# Altium project Balancer_PCB.PrjPcb
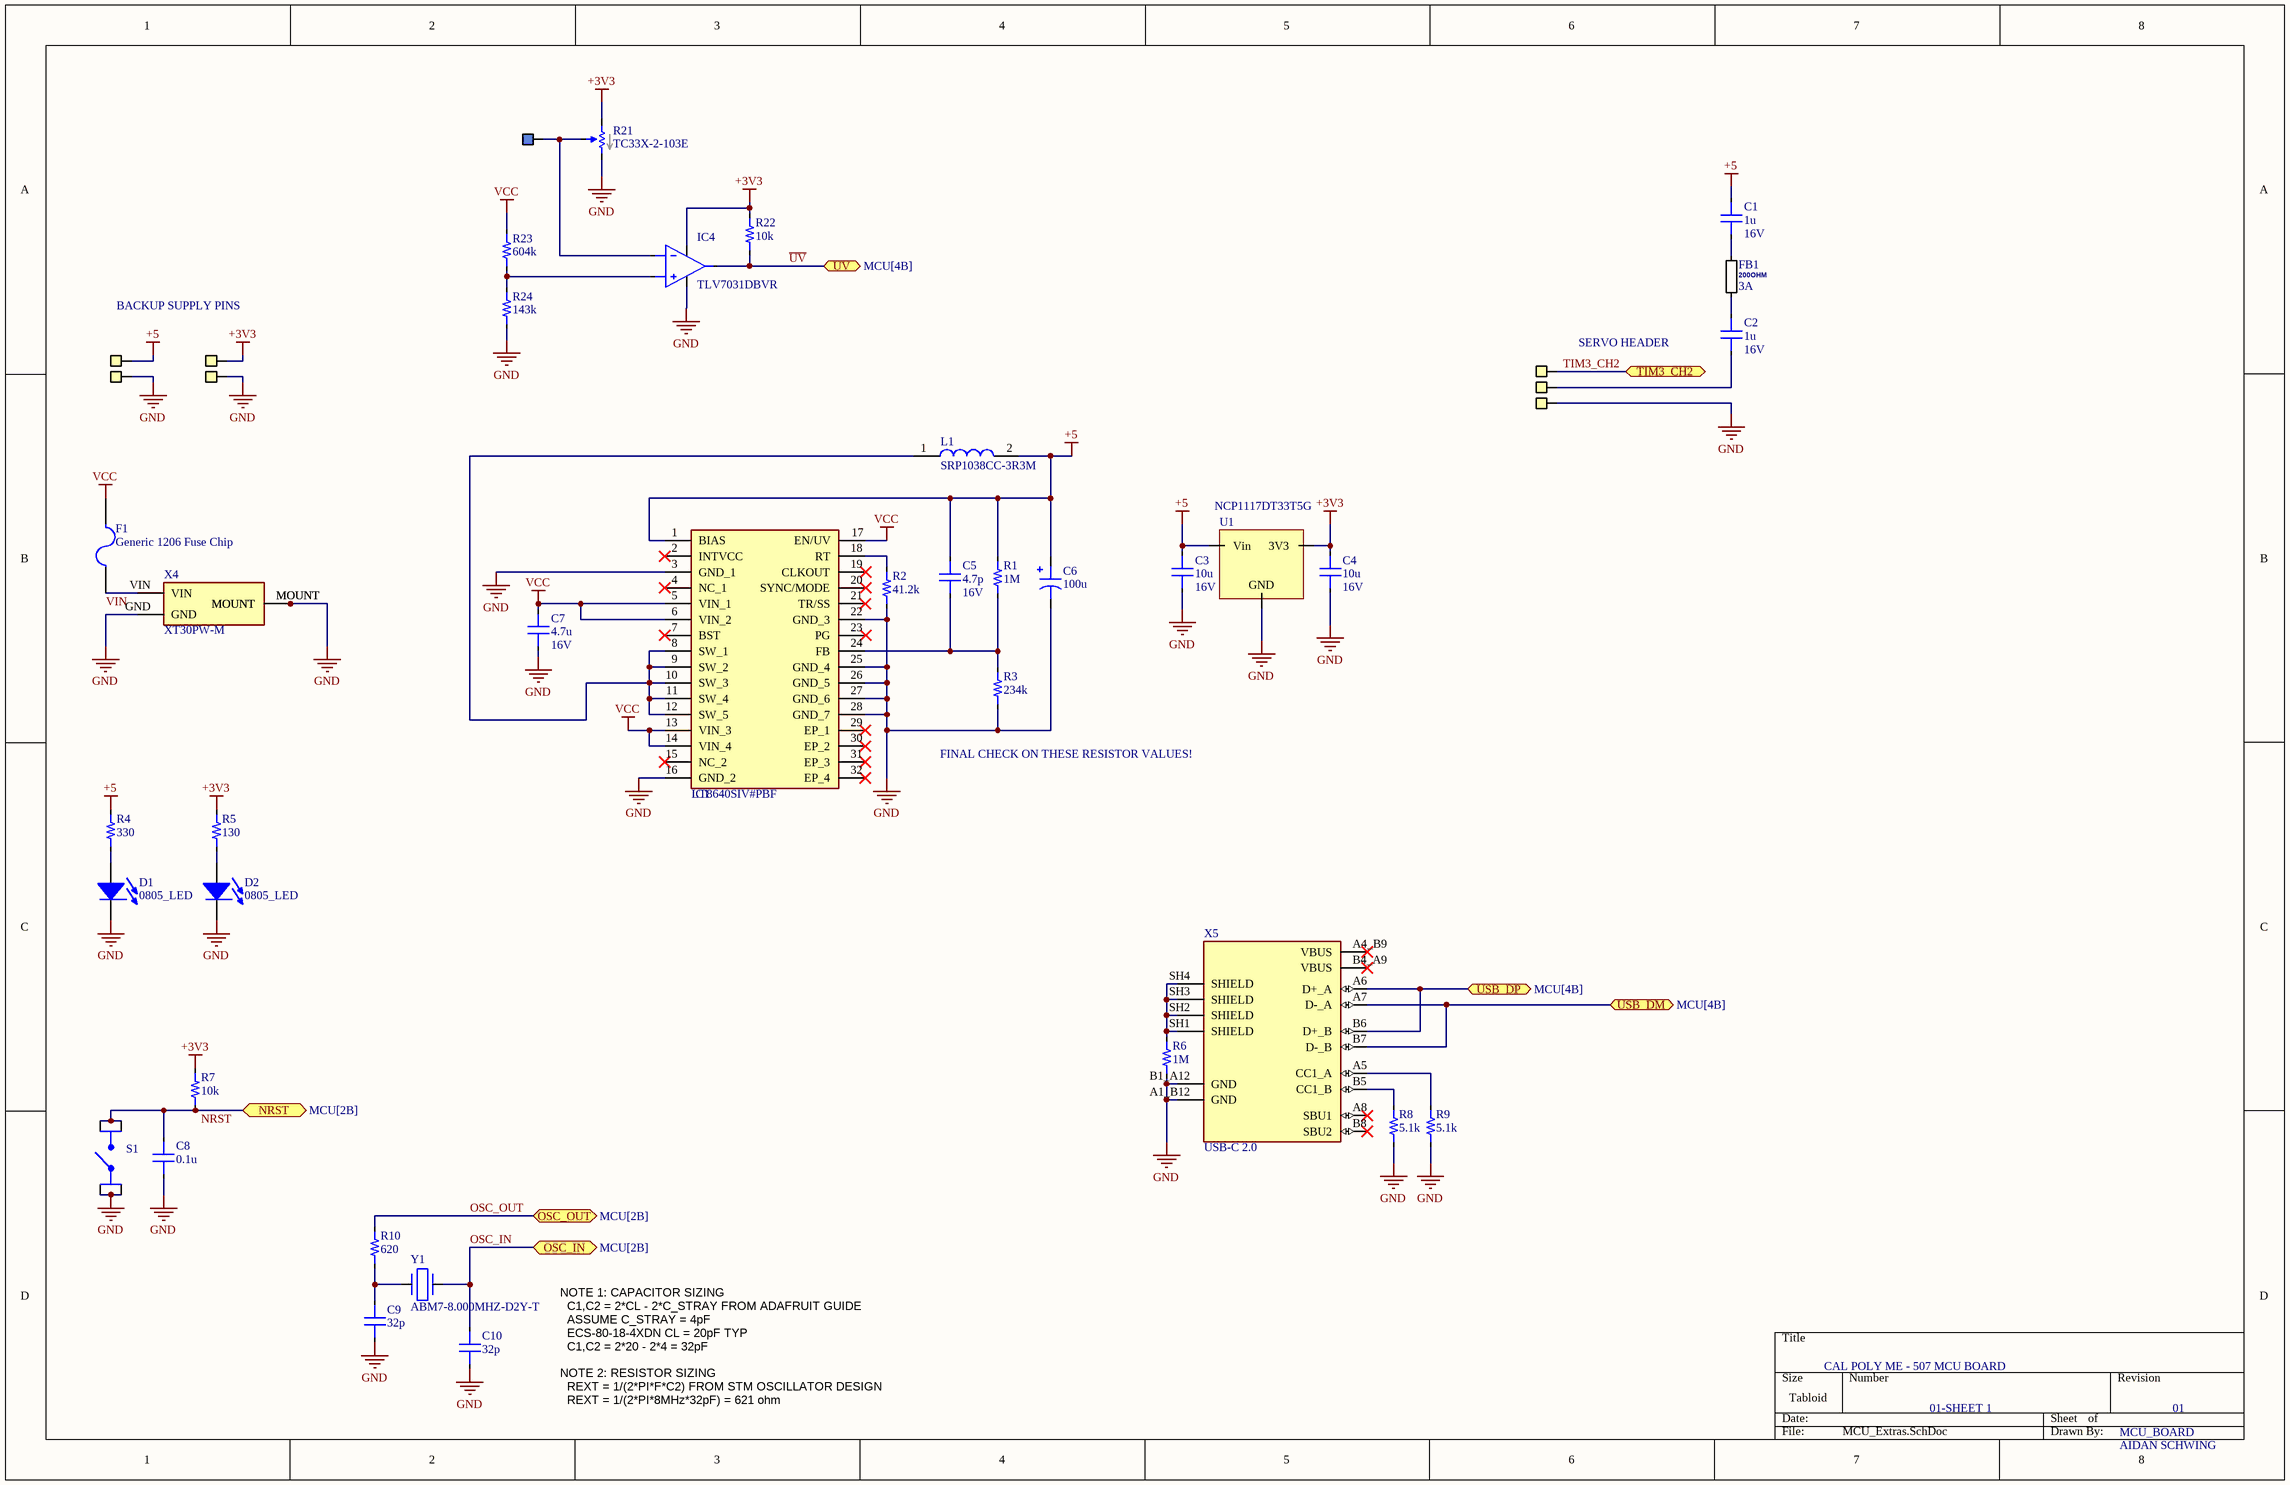
[diagram p0: MCU_Extras.SchDoc]
3 sheets, 93 parts. Net scope: flat (ports and power ports of the same name join across sheets).
Board file: BALANCER_PCB.PcbDoc
Sheets:
  MCU_Extras.SchDoc
  IMU.SchDoc
  MCU.SchDoc

## Sheet MCU_Extras.SchDoc
size Tabloid; SheetNumber: 1; SheetTotal: 3

### Parts
C1  value 1u  Voltage: 16V  [0603_CAP]  (hidden comment: Capacitor)
C2  value 1u  Voltage: 16V  [0603_CAP]  (hidden comment: Capacitor)
C3  value 10u  Voltage: 16V  [0805_CAP]  (hidden comment: Capacitor)
C4  value 10u  Voltage: 16V  [0805_CAP]  (hidden comment: Capacitor)
C5  value 4.7p  Voltage: 16V  [0603_CAP]  (hidden comment: Capacitor)
C6  value 100u  [6.60x6.60x8.00mm_E_CAP]  (hidden comment: 865080343009)
C7  value 4.7u  Voltage: 16V  [0805_CAP]  (hidden comment: Capacitor)
C8  value 0.1u  [0805_CAP]  (hidden comment: Capacitor)
C9  value 32p  [0805_CAP]  (hidden comment: Capacitor)
C10  value 32p  [0805_CAP]  (hidden comment: Capacitor)
D1  0805_LED  [0805_LED]
D2  0805_LED  [0805_LED]
F1  Generic 1206 Fuse Chip  [1206_RES]
FB1  =Z@100MHz: 200OHM  iMax: 3A  [0805_Ferrite]  (hidden comment: *)
IC1  LT8640SIV#PBF  [LT8640SIVPBF]
IC4  TLV7031DBVR  [SOT95P280X145-5N]
L1  SRP1038CC-3R3M  [INDPM110100X400N]
R1  value 1M  [0805_RES]  (hidden comment: Resistor)
R2  value 41.2k  [0805_RES]  (hidden comment: Resistor)
R3  value 234k  [0805_RES]  (hidden comment: Resistor)
R4  value 330  [0603_RES]  (hidden comment: Resistor)
R5  value 130  [0603_RES]  (hidden comment: Resistor)
R6  value 1M  [0805_RES]  (hidden comment: Resistor)
R7  value 10k  [0603_RES]  (hidden comment: Resistor)
R8  value 5.1k  [0805_RES]  (hidden comment: Resistor)
R9  value 5.1k  [0805_RES]  (hidden comment: Resistor)
R10  value 620  [0805_RES]  (hidden comment: Resistor)
R21  TC33X-2-103E  [35WR]
R22  value 10k  [0805_RES]  (hidden comment: Resistor)
R23  value 604k  [0805_RES]  (hidden comment: Resistor)
R24  value 143k  [0805_RES]  (hidden comment: Resistor)
S1  TactileSwitch  [6mmTactileSwitch_ThroughHole]  (value not drawn)
U1  NCP1117DT33T5G  [DPAK3_TO-252-3]
X1  GenericPinHeader(0.1in)  [GenericPinHeader(.1in)]  (value not drawn)
X2  GenericPinHeader(0.1in)  [GenericPinHeader(.1in)]  (value not drawn)
X3  GenericPinHeader(0.1in)  [GenericPinHeader(.1in)]  (value not drawn)
X4  XT30PW-M  [XT30PWM]
X5  USB-C 2.0  [AMPHENOL_12402012E212A]
X11  HeaderPad  [HeaderPad]  (value not drawn)
X19  GenericPinHeader(0.1in)  [GenericPinHeader(.1in)]  (value not drawn)
X22  GenericPinHeader(0.1in)  [GenericPinHeader(.1in)]  (value not drawn)
X23  GenericPinHeader(0.1in)  [GenericPinHeader(.1in)]  (value not drawn)
X26  GenericPinHeader(0.1in)  [GenericPinHeader(.1in)]  (value not drawn)
Y1  ABM7-8.000MHZ-D2Y-T  [ABM7]

### Ports
NRST (bidir, see MCU[2B]), OSC_IN (bidir, see MCU[2B]), OSC_OUT (bidir, see MCU[2B]), TIM3_CH2 (bidir, see MCU[4B]), USB_DM (bidir, see MCU[4B]), USB_DP (bidir, see MCU[4B]), ~{UV} (bidir, see MCU[4B])

### Nets
+3V3: C4.1 IC4.5(VCC) R5.2 R7.2 R21.1 R22.2 U1.4(3V3) X22.1(Pin)
+5: C1.1 C3.1 C5.1 C6.1 IC1.1(BIAS) L1.2 R1.2 R4.2 U1.3(Vin) X19.1(Pin)
GND: C3.2 C4.2 C6.2 C7.2 C8.1 C9.1 C10.1 D1.2(K) D2.2(K) IC1.3(GND_1) IC1.16(GND_2) IC1.22(GND_3) IC1.25(GND_4) IC1.26(GND_5) IC1.27(GND_6) IC1.28(GND_7) IC4.2(VEE) R2.1 R3.1 R6.1 R8.1 R9.1 R21.3 R24.1 S1.1 S1.2 U1.1(GND) X3.1(Pin) X4.GND X4.MOUNT X5.A1_B12(GND) X5.B1_A12(GND) X23.1(Pin) X26.1(Pin)
VCC: C7.1 F1.2 IC1.5(VIN_1) IC1.6(VIN_2) IC1.13(VIN_3) IC1.14(VIN_4) IC1.17(EN/UV) R23.2
NRST: C8.2 R7.1 S1.3 S1.4 ; port NRST
OSC_IN: C10.2 Y1.2 ; port OSC_IN
OSC_OUT: R10.2 ; port OSC_OUT
TIM3_CH2: X1.1(Pin) ; port TIM3_CH2
~{UV}: IC4.1(OUT) R22.1 ; port ~{UV}
USB_DM: X5.A7(D-_A) X5.B7(D-_B) ; port USB_DM
USB_DP: X5.A6(D+_A) X5.B6(D+_B) ; port USB_DP
VIN: F1.1 X4.VIN
NetC1_2: C1.2 FB1.2
NetC2_1: C2.1 FB1.1
NetC2_2: C2.2 X2.1(Pin)
NetC5_2: C5.2 IC1.24(FB) R1.1 R3.2
NetC9_2: C9.2 R10.1 Y1.1
NetD1_1: D1.1(A) R4.1
NetD2_1: D2.1(A) R5.1
NetIC1_8: IC1.8(SW_1) IC1.9(SW_2) IC1.10(SW_3) IC1.11(SW_4) IC1.12(SW_5) L1.1
NetIC1_18: IC1.18(RT) R2.2
NetIC4_3: IC4.3(IN+) R23.1 R24.2
NetIC4_4: IC4.4(IN-) R21.2 X11.1(Pin)
NetR6_2: R6.2 X5.SH1(SHIELD) X5.SH2(SHIELD) X5.SH3(SHIELD) X5.SH4(SHIELD)
NetR8_2: R8.2 X5.B5(CC1_B)
NetR9_2: R9.2 X5.A5(CC1_A)

Not connected (* = marked no-connect by the designer): IC1 2(INTVCC)* 4(NC_1)* 7(BST)* 15(NC_2)* 19(CLKOUT)* 20(SYNC/MODE)* 21(TR/SS)* 23(PG)* 29(EP_1)* 30(EP_2)* 31(EP_3)* 32(EP_4)*; X5 A4_B9(VBUS)* A8(SBU1)* B4_A9(VBUS)* B8(SBU2)*

### Notes on the sheet
- BACKUP SUPPLY PINS
- SERVO HEADER
- (near R3) FINAL CHECK ON THESE RESISTOR VALUES!
- CAL POLY ME - 507 MCU BOARD
- NOTE 1: CAPACITOR SIZING
  C1,C2 = 2*CL - 2*C_STRAY FROM ADAFRUIT GUIDE
  ASSUME C_STRAY = 4pF
  ECS-80-18-4XDN CL = 20pF TYP
  C1,C2 = 2*20 - 2*4 = 32pF
  NOTE 2: RESISTOR SIZING
  REXT = 1/(2*PI*F*C2) FROM STM OSCILLATOR DESIGN
  REXT = 1/(2*PI*8MHz*32pF) = 621 ohm
- 01-SHEET 1
- MCU_BOARD
- 01
- AIDAN SCHWING

### Library data of the parts
C6 = 865080343009: CAP ALUM 100UF 20% 16V SMD; Percent Tolerance: 20; Dielectric: *; ESR: *; ComponentLink1Description: Digikey; ComponentLink1URL: https://www.digikey.com/en/products/detail/w%C3%BCrth-elektronik/865080343009/5728014
D1 D2 = 0805_LED: Generic 0805 LED
FB1 = ChipFerrite: Link: *; MfrPartNo: *; Name: *; Resistance: *; Package: *; Inductance: *
IC1 = LT8640SIV#PBF: Integrated Circuit; Manufacturer_Name: Analog Devices; Datasheet Link: https://www.analog.com/LT8640S/datasheet; Height: 1.03mm; Manufacturer_Part_Number: LT8640SIV#PBF; Mouser Part Number: 584-LT8640SIVPBF; Mouser Price/Stock: https://www.mouser.co.uk/ProductDetail/Analog-Devices/LT8640SIVPBF?qs=5aG0NVq1C4wLdtPauIE3hA%3D%3D; Arrow Part Number: LT8640SIV#PBF; Arrow Price/Stock: https://www.arrow.com/en/products/lt8640sivpbf/analog-devices
IC4 = TLV7031DBVR: Analog Comparators Nanopower, small size comparator with push-pull output 5-SOT-23 -40 to 125C range; Manufacturer_Name: Texas Instruments; Datasheet Link: http://www.ti.com/lit/gpn/TLV7031; Height: 1.45mm; Manufacturer_Part_Number: TLV7031DBVR; Mouser Part Number: 595-TLV7031DBVR; Mouser Price/Stock: https://www.mouser.co.uk/ProductDetail/Texas-Instruments/TLV7031DBVR?qs=EBDBlbfErPzxbC0zg598sw%3D%3D; Arrow Part Number: TLV7031DBVR; Arrow Price/Stock: https://www.arrow.com/en/products/tlv7031dbvr/texas-instruments?region=nac
L1 = SRP1038CC-3R3M: Inductor, 3.3uH; Manufacturer_Name: Bourns; Manufacturer_Part_Number: SRP1038CC-4R7M; Datasheet Link: https://www.digikey.com/en/products/detail/bourns-inc/SRP1038CC-3R3M/21263957?s=N4IgTCBcDaIMoCUAKBGADAZgBwGEcFoMEMBZEAXQF8g; Height: 4mm
R21 = TC33X-2-103E: 0.1W, 1/10W J Lead Surface Mount Trimmer Potentiometer Cermet Turn Top Adjustment; Value: 10k; ComponentLink1Description: Digikey; ComponentLink1URL: https://www.digikey.com/en/products/detail/bourns-inc/TC33X-2-103E/612911; Power: 1/10W
S1 = TactileSwitch: Generic 6mm Through Hole Tactile Switch; Current: 0.05A; MaxVoltage: 12V; Pole: 1; Name: TactileSwitch; Mounting: TH; ComponentLink1Description: Digikey; ComponentLink1URL: https://www.digikey.com/en/products/detail/c-k/PTS645SH95-2-LFS/1146763
U1 = NCP1117DT33T5G: IC REG LINEAR 3.3V 1A DPAK
X1-X3 X19 X22 X23 X26 = GenericPinHeader(0.1in): Generic .1in(2.54mm) pitch pin header
X4 = XT30PW-M: Socket; DC supply; XT30; male; PIN: 2; on PCBs; THT; yellow; 15A; 500V; Manufacturer_Name: Amass; Datasheet Link: https://www.tme.eu/sl/Document/ce4077e36b79046da520ca73227e15de/XT30PW%20SPEC.pdf; Height: 5mm; Manufacturer_Part_Number: XT30PW-M
X5 = 12402012E212A: CONN RCP USB2.0 TYP C 24P SMD RA; MF: {'manufacturer': u'Amphenol'}; Package: None; Price: None; Value: *; MP: 12402012E212A; Availability: Unavailable
X11 = HeaderPad: Pad for pin header
Y1 = ABM7-8.000MHZ-D2Y-T: Crystal or Oscillator; Manufacturer_Name: ABRACON; Datasheet Link: https://abracon.com/Resonators/abm7.pdf; Height: 1.4mm; Manufacturer_Part_Number: ABM7-8.000MHZ-D2Y-T; Mouser Part Number: 815-ABM7-8-D2Y-T; Mouser Price/Stock: https://www.mouser.co.uk/ProductDetail/ABRACON/ABM7-8.000MHZ-D2Y-T?qs=LoTOQoUkC8SFsmY8snleBA%3D%3D; Arrow Part Number: ABM7-8.000MHZ-D2Y-T; Arrow Price/Stock: https://www.arrow.com/en/products/abm7-8.000mhz-d2y-t/abracon?region=europe
C1-C5 C7-C10 = Capacitor: Dielectric: *; Percent Tolerance: *; ESR: *
R1-R10 R22-R24 = Resistor: Tolerance: *

## Sheet IMU.SchDoc
size Letter; SheetNumber: 2; SheetTotal: 3
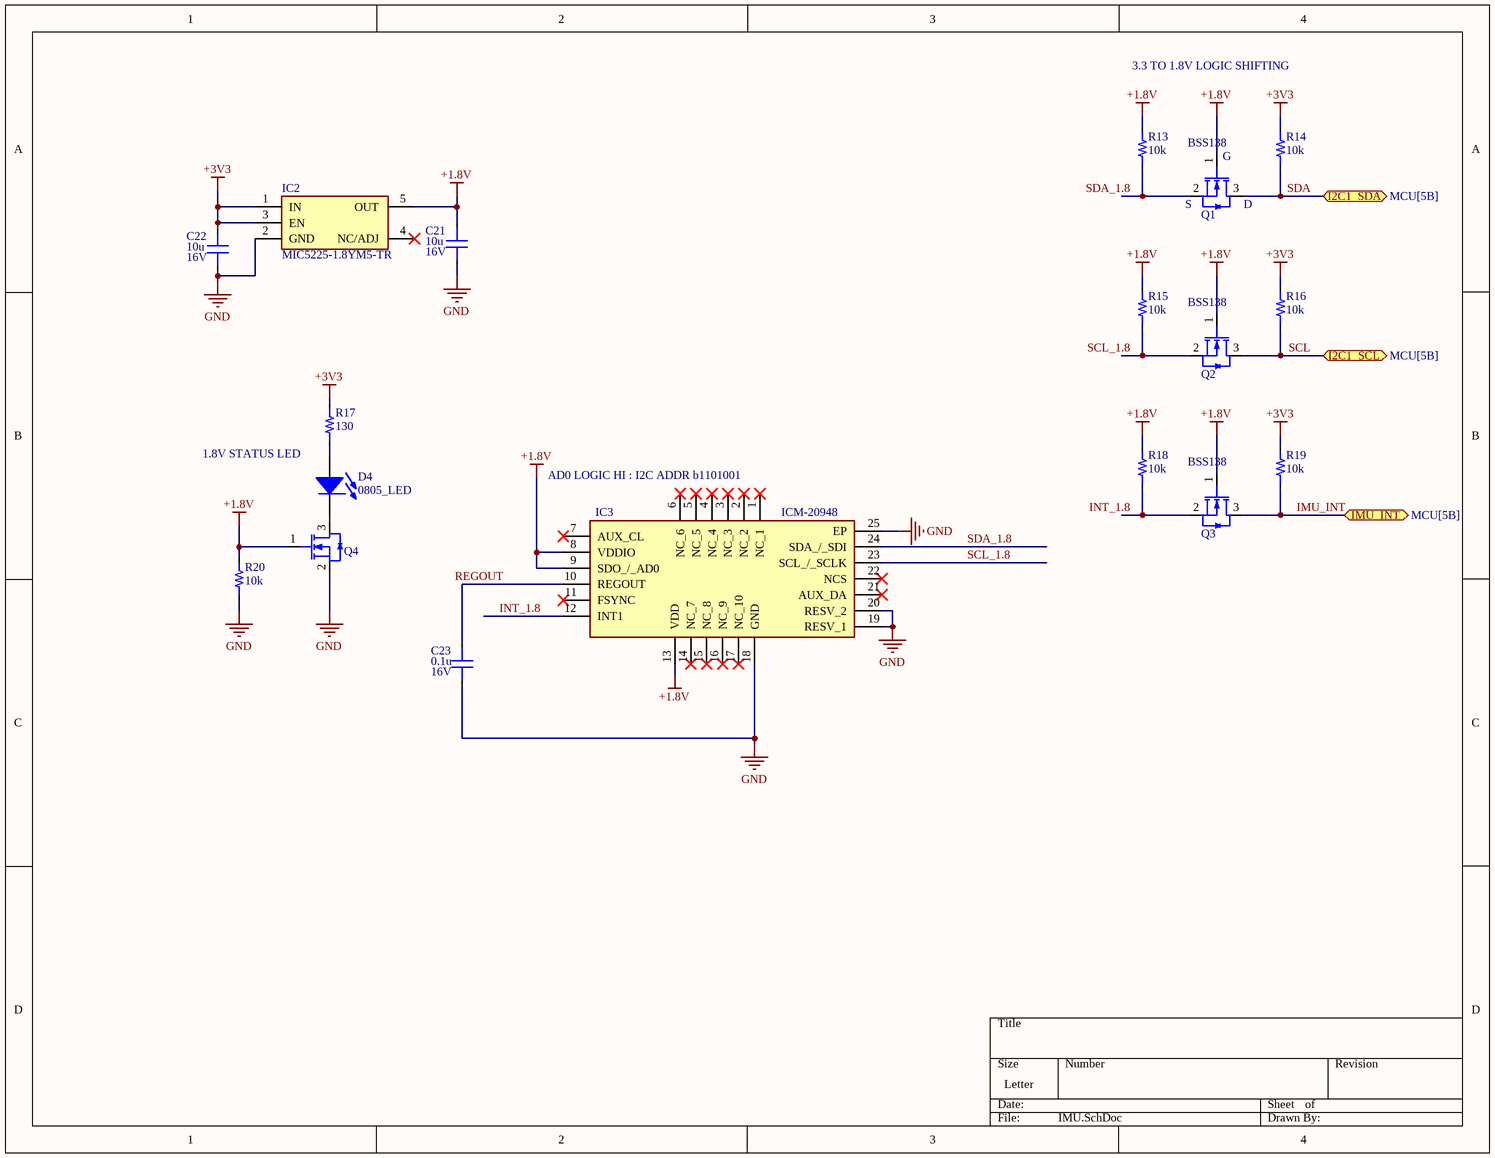
[diagram p1: IMU.SchDoc]

### Parts
C21  value 10u  Voltage: 16V  [0603_CAP]  (hidden comment: Capacitor)
C22  value 10u  Voltage: 16V  [0603_CAP]  (hidden comment: Capacitor)
C23  value 0.1u  Voltage: 16V  [0603_CAP]  (hidden comment: Capacitor)
D4  0805_LED  [0805_LED]
IC2  MIC5225-1.8YM5-TR  [SOT95P280X130-5N]
IC3  ICM-20948  [QFN40P300X300X105-25N-D]
Q1  BSS138  [SOT95P240X120-3N]
Q2  BSS138  [SOT95P240X120-3N]
Q3  BSS138  [SOT95P240X120-3N]
Q4  BSS138  [SOT95P240X120-3N]  (value not drawn)
R13  value 10k  [0603_RES]  (hidden comment: Resistor)
R14  value 10k  [0603_RES]  (hidden comment: Resistor)
R15  value 10k  [0603_RES]  (hidden comment: Resistor)
R16  value 10k  [0603_RES]  (hidden comment: Resistor)
R17  value 130  [0603_RES]  (hidden comment: Resistor)
R18  value 10k  [0603_RES]  (hidden comment: Resistor)
R19  value 10k  [0603_RES]  (hidden comment: Resistor)
R20  value 10k  [0603_RES]  (hidden comment: Resistor)

### Ports
I2C1_SCL (bidir, see MCU[5B]), I2C1_SDA (bidir, see MCU[5B]), IMU_INT (bidir, see MCU[5B])

### Nets
+1.8V: C21.2 IC2.5(OUT) IC3.8(VDDIO) IC3.9(SDO_/_AD0) IC3.13(VDD) Q1.1(G) Q2.1(G) Q3.1(G) Q4.1(G) R13.2 R15.2 R18.2 R20.2
+3V3: C22.2 IC2.1(IN) IC2.3(EN) R14.2 R16.2 R17.2 R19.2
GND: C21.1 C22.1 C23.1 IC2.2(GND) IC3.18(GND) IC3.19(RESV_1) IC3.20(RESV_2) IC3.25(EP) Q4.2(S) R20.1
IMU_INT: Q3.3(D) R19.1 ; port IMU_INT
INT_1.8: IC3.12(INT1) Q3.2(S) R18.1
REGOUT: C23.2 IC3.10(REGOUT)
SCL: Q2.3(D) R16.1 ; port I2C1_SCL
SCL_1.8: IC3.23(SCL_/_SCLK) Q2.2(S) R15.1
SDA: Q1.3(D) R14.1 ; port I2C1_SDA
SDA_1.8: IC3.24(SDA_/_SDI) Q1.2(S) R13.1
NetD4_1: D4.1(A) R17.1
NetD4_2: D4.2(K) Q4.3(D)

Not connected (* = marked no-connect by the designer): IC2 4(NC/ADJ)*; IC3 1(NC_1)* 2(NC_2)* 3(NC_3)* 4(NC_4)* 5(NC_5)* 6(NC_6)* 7(AUX_CL)* 11(FSYNC)* 14(NC_7)* 15(NC_8)* 16(NC_9)* 17(NC_10)* 21(AUX_DA)* 22(NCS)*

### Notes on the sheet
- 3.3 TO 1.8V LOGIC SHIFTING
- (near Q1) G
- (near Q1) S
- (near Q1) D
- 1.8V STATUS LED
- (near IC3) AD0 LOGIC HI : I2C ADDR b1101001

### Library data of the parts
D4 = 0805_LED: Generic 0805 LED
IC2 = MIC5225-1.8YM5-TR: Integrated Circuit; Manufacturer_Name: Microchip; Datasheet Link: http://www.microchip.com/mymicrochip/filehandler.aspx?ddocname=en579718; Height: 1.3mm; Manufacturer_Part_Number: MIC5225-1.8YM5-TR; Mouser Part Number: 998-MIC5225-1.8YM5TR; Mouser Price/Stock: https://www.mouser.co.uk/ProductDetail/Microchip-Technology/MIC5225-1.8YM5-TR?qs=U6T8BxXiZAW23RI71jjM5w%3D%3D; Arrow Part Number: MIC5225-1.8YM5-TR; Arrow Price/Stock: https://www.arrow.com/en/products/mic5225-1.8ym5-tr/microchip-technology?region=nac
IC3 = ICM-20948: Integrated Circuit; Manufacturer_Name: TDK; Datasheet Link: https://product.tdk.com/system/files/dam/doc/product/sensor/mortion-inertial/imu/data_sheet/ds-000189-icm-20948-v1.3.pdf; Height: 1.05mm; Manufacturer_Part_Number: ICM-20948; Mouser Part Number: 410-ICM-20948; Mouser Price/Stock: https://www.mouser.co.uk/ProductDetail/TDK-InvenSense/ICM-20948?qs=u4fy%2FsgLU9OtGc31yF%2Friw%3D%3D; Arrow Part Number: ICM-20948; Arrow Price/Stock: https://www.arrow.com/en/products/icm-20948/invensense?region=nac
Q1-Q4 = BSS138: MOSFET (N-Channel); Manufacturer_Name: onsemi; Datasheet Link: https://www.onsemi.com/pub/Collateral/BSS138-D.PDF; Height: 1.2mm; Manufacturer_Part_Number: BSS138; Mouser Part Number: 512-BSS138; Mouser Price/Stock: https://www.mouser.co.uk/ProductDetail/onsemi-Fairchild/BSS138?qs=HK%252BeIG1iaahCeqBvjB4arg%3D%3D; Arrow Part Number: BSS138; Arrow Price/Stock: https://www.arrow.com/en/products/bss138/on-semiconductor
C21-C23 = Capacitor: Dielectric: *; Percent Tolerance: *; ESR: *
R13-R20 = Resistor: Tolerance: *

## Sheet MCU.SchDoc
size Tabloid; SheetNumber: 3; SheetTotal: 3
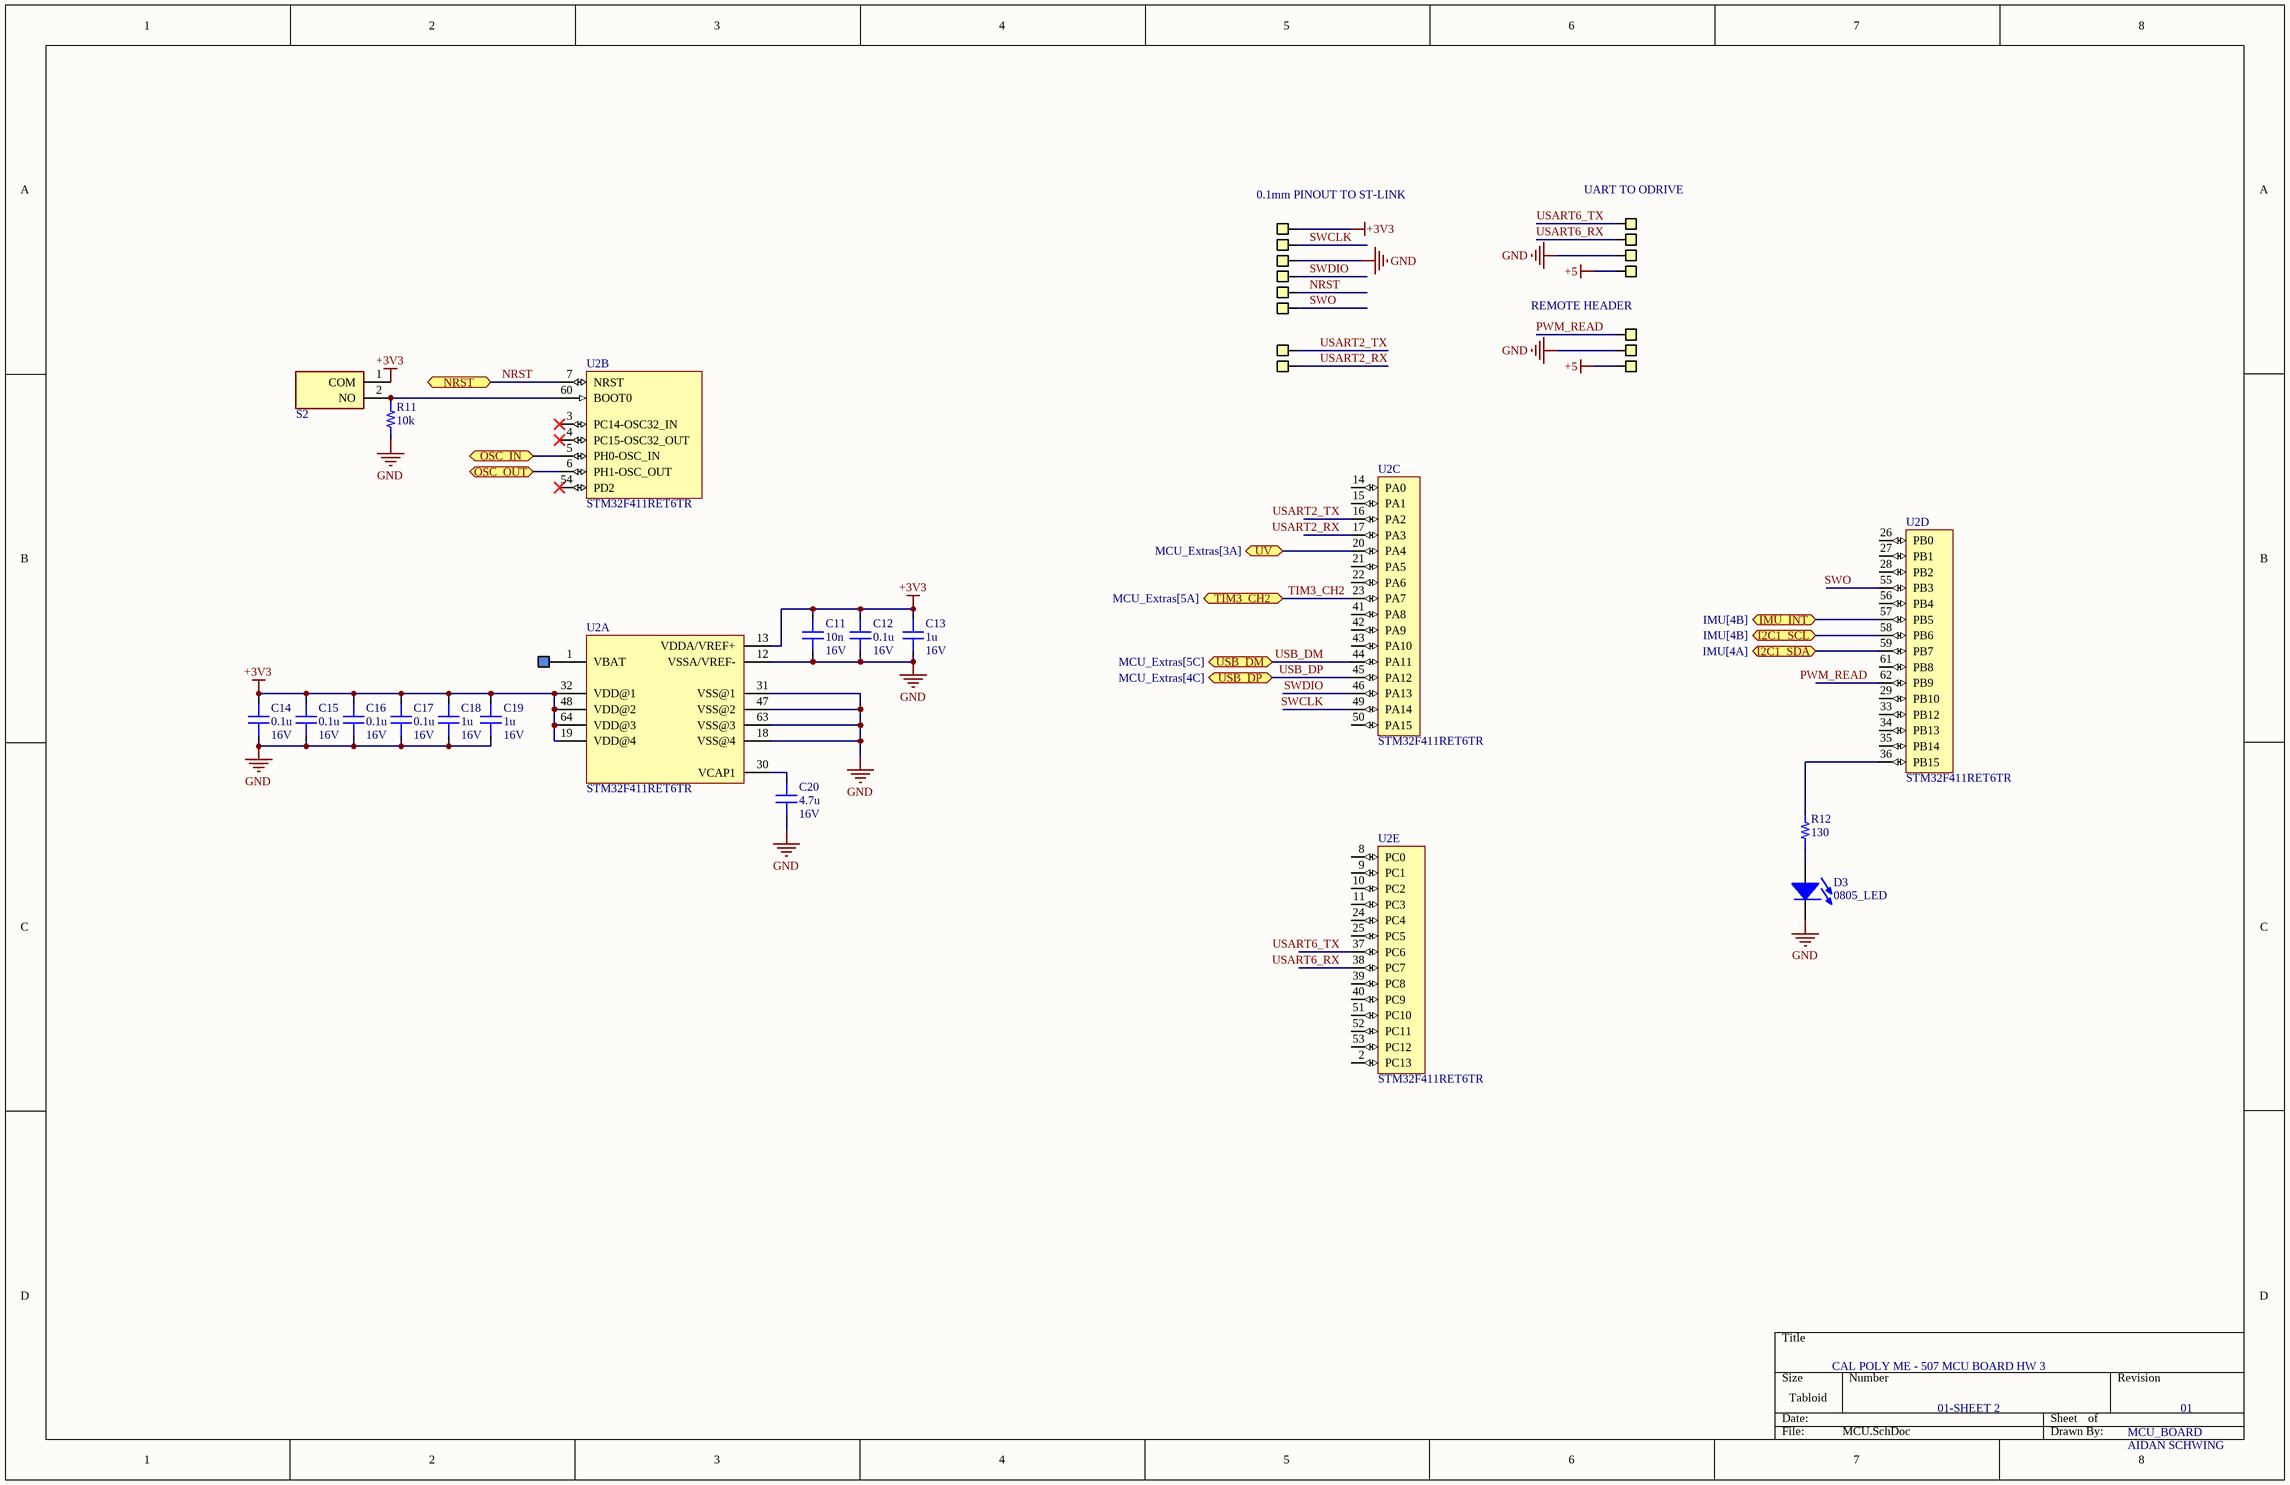
[diagram p2: MCU.SchDoc]

### Parts
C11  value 10n  Voltage: 16V  [0805_CAP]  (hidden comment: Capacitor)
C12  value 0.1u  Voltage: 16V  [0805_CAP]  (hidden comment: Capacitor)
C13  value 1u  Voltage: 16V  [0805_CAP]  (hidden comment: Capacitor)
C14  value 0.1u  Voltage: 16V  [0805_CAP]  (hidden comment: Capacitor)
C15  value 0.1u  Voltage: 16V  [0805_CAP]  (hidden comment: Capacitor)
C16  value 0.1u  Voltage: 16V  [0805_CAP]  (hidden comment: Capacitor)
C17  value 0.1u  Voltage: 16V  [0805_CAP]  (hidden comment: Capacitor)
C18  value 1u  Voltage: 16V  [0805_CAP]  (hidden comment: Capacitor)
C19  value 1u  Voltage: 16V  [0805_CAP]  (hidden comment: Capacitor)
C20  value 4.7u  Voltage: 16V  [0805_CAP]  (hidden comment: Capacitor)
D3  0805_LED  [0805_LED]
R11  value 10k  [0603_RES]  (hidden comment: Resistor)
R12  value 130  [0603_RES]  (hidden comment: Resistor)
S2  DS04-254-2-01BK-SMT-TR  [DS04254201BKSMTTR]  (value not drawn)
U2  STM32F411RET6TR  [QFP50P1200X1200X160-64N]  (parts A,B,C,D,E of 5)
X6  GenericPinHeader(0.1in)  [GenericPinHeader(.1in)]  (value not drawn)
X7  GenericPinHeader(0.1in)  [GenericPinHeader(.1in)]  (value not drawn)
X8  GenericPinHeader(0.1in)  [GenericPinHeader(.1in)]  (value not drawn)
X9  GenericPinHeader(0.1in)  [GenericPinHeader(.1in)]  (value not drawn)
X10  GenericPinHeader(0.1in)  [GenericPinHeader(.1in)]  (value not drawn)
X12  GenericPinHeader(0.1in)  [GenericPinHeader(.1in)]  (value not drawn)
X13  GenericPinHeader(0.1in)  [GenericPinHeader(.1in)]  (value not drawn)
X14  GenericPinHeader(0.1in)  [GenericPinHeader(.1in)]  (value not drawn)
X15  GenericPinHeader(0.1in)  [GenericPinHeader(.1in)]  (value not drawn)
X16  GenericPinHeader(0.1in)  [GenericPinHeader(.1in)]  (value not drawn)
X17  HeaderPad  [HeaderPad]  (value not drawn)
X18  GenericPinHeader(0.1in)  [GenericPinHeader(.1in)]  (value not drawn)
X20  GenericPinHeader(0.1in)  [GenericPinHeader(.1in)]  (value not drawn)
X21  GenericPinHeader(0.1in)  [GenericPinHeader(.1in)]  (value not drawn)
X24  GenericPinHeader(0.1in)  [GenericPinHeader(.1in)]  (value not drawn)
X25  GenericPinHeader(0.1in)  [GenericPinHeader(.1in)]  (value not drawn)

### Ports
I2C1_SCL (bidir, see IMU[4B]), I2C1_SDA (bidir, see IMU[4A]), IMU_INT (bidir, see IMU[4B]), NRST (bidir, see MCU_Extras[1C]), OSC_IN (bidir, see MCU_Extras[2D]), OSC_OUT (bidir, see MCU_Extras[2D]), TIM3_CH2 (bidir, see MCU_Extras[5A]), USB_DM (bidir, see MCU_Extras[5C]), USB_DP (bidir, see MCU_Extras[4C]), ~{UV} (bidir, see MCU_Extras[3A])

### Nets
+3V3: C11.1 C12.1 C13.1 C14.1 C15.1 C16.1 C17.1 C18.1 C19.1 S2.1(COM) U2.13(VDDA/VREF+) U2.19(VDD@4) U2.32(VDD@1) U2.48(VDD@2) U2.64(VDD@3) X7.1(Pin)
+5: X21.1(Pin) X25.1(Pin)
GND: C11.2 C12.2 C13.2 C14.2 C15.2 C16.2 C17.2 C18.2 C19.2 C20.2 D3.2(K) R11.1 U2.12(VSSA/VREF-) U2.18(VSS@4) U2.31(VSS@1) U2.47(VSS@2) U2.63(VSS@3) X10.1(Pin) X20.1(Pin) X24.1(Pin)
IMU_INT: U2.57(PB5) ; port IMU_INT
NRST: U2.7(NRST) X13.1(Pin) ; port NRST
OSC_IN: U2.5(PH0-OSC_IN) ; port OSC_IN
OSC_OUT: U2.6(PH1-OSC_OUT) ; port OSC_OUT
PWM_READ: U2.62(PB9) X18.1(Pin)
SCL: U2.58(PB6) ; port I2C1_SCL
SDA: U2.59(PB7) ; port I2C1_SDA
SWCLK: U2.49(PA14) X8.1(Pin)
SWDIO: U2.46(PA13) X12.1(Pin)
SWO: U2.55(PB3) X14.1(Pin)
TIM3_CH2: U2.23(PA7) ; port TIM3_CH2
~{UV}: U2.20(PA4) ; port ~{UV}
USART2_RX: U2.17(PA3) X16.1(Pin)
USART2_TX: U2.16(PA2) X15.1(Pin)
USART6_RX: U2.38(PC7) X9.1(Pin)
USART6_TX: U2.37(PC6) X6.1(Pin)
USB_DM: U2.44(PA11) ; port USB_DM
USB_DP: U2.45(PA12) ; port USB_DP
NetC20_1: C20.1 U2.30(VCAP1)
NetD3_1: D3.1(A) R12.1
NetR11_2: R11.2 S2.2(NO) U2.60(BOOT0)
NetR12_2: R12.2 U2.36(PB15)
NetU2_1: U2.1(VBAT) X17.1(Pin)

Not connected (* = marked no-connect by the designer): U2 2(PC13) 3(PC14-OSC32_IN)* 4(PC15-OSC32_OUT)* 8(PC0) 9(PC1) 10(PC2) 11(PC3) 14(PA0) 15(PA1) 21(PA5) 22(PA6) 24(PC4) 25(PC5) 26(PB0) 27(PB1) 28(PB2) 29(PB10) 33(PB12) 34(PB13) 35(PB14) 39(PC8) 40(PC9) 41(PA8) 42(PA9) 43(PA10) 50(PA15) 51(PC10) 52(PC11) 53(PC12) 54(PD2)* 56(PB4) 61(PB8)

### Notes on the sheet
- 0.1mm PINOUT TO ST-LINK
- UART TO ODRIVE
- REMOTE HEADER
- CAL POLY ME - 507 MCU BOARD HW 3
- 01-SHEET 2
- MCU_BOARD
- 01
- AIDAN SCHWING

### Library data of the parts
D3 = 0805_LED: Generic 0805 LED
S2 = DS04-254-2-01BK-SMT-TR: DIP Switches / SIP Switches DIP Switch, SPST, 2.54 pitch, flat actuator, SMT, Tape and reel, 1 position, Black; Manufacturer_Name: CUI Devices; Datasheet Link: https://www.cuidevices.com/product/resource/supplyframepdf/ds04-254-smt.pdf; Height: 4.3mm; Manufacturer_Part_Number: DS04-254-2-01BK-SMT-TR; Mouser Part Number: 490-DS04254201BK-STR; Mouser Price/Stock: https://www.mouser.co.uk/ProductDetail/CUI-Devices/DS04-254-2-01BK-SMT-TR?qs=wnTfsH77Xs4xXRFXKF0ssg%3D%3D; Arrow Part Number: DS04-254-2-01BK-SMT-TR; Arrow Price/Stock: https://www.arrow.com/en/products/ds04-254-2-01bk-smt-tr/cui-devices?region=nac
U2 = STM32F411RET6TR: High-performance access line, ARM Cortex-M4 core with DSP and FPU, 512 Kbytes Flash, 100 MHz CPU, ART Accelerator; MF: {'manufacturer': u'STMicroelectronics'}; Package: None; Price: None; Value: *; MP: STM32F411RET6TR; Availability: Unavailable
X6-X10 X12-X16 X18 X20 X21 X24 X25 = GenericPinHeader(0.1in): Generic .1in(2.54mm) pitch pin header
X17 = HeaderPad: Pad for pin header
C11-C20 = Capacitor: Dielectric: *; Percent Tolerance: *; ESR: *
R11 R12 = Resistor: Tolerance: *

## Nets that join several sheets
+3V3: MCU_Extras (8 pins), IMU (7 pins), MCU (16 pins)
+5: MCU_Extras (10 pins), MCU (X21.1 X25.1)
GND: MCU_Extras (34 pins), IMU (10 pins), MCU (20 pins)
IMU_INT: IMU (Q3.3 R19.1), MCU (U2.57)
NRST: MCU_Extras (C8.2 R7.1 S1.3 S1.4), MCU (U2.7 X13.1)
OSC_IN: MCU_Extras (C10.2 Y1.2), MCU (U2.5)
OSC_OUT: MCU_Extras (R10.2), MCU (U2.6)
SCL: IMU (Q2.3 R16.1), MCU (U2.58)
SDA: IMU (Q1.3 R14.1), MCU (U2.59)
TIM3_CH2: MCU_Extras (X1.1), MCU (U2.23)
~{UV}: MCU_Extras (IC4.1 R22.1), MCU (U2.20)
USB_DM: MCU_Extras (X5.A7 X5.B7), MCU (U2.44)
USB_DP: MCU_Extras (X5.A6 X5.B6), MCU (U2.45)